# Altium schematic sheet MCU.SchDoc: Science - Microcontroller
size Letter; DrawnBy: C.Arjune; Organization: UW Robotics; Address1: 200 University Avenue; Address2: Waterloo; Address3: Ontario; Address4: Canada N2L 3G6; SheetNumber: 3; SheetTotal: 5
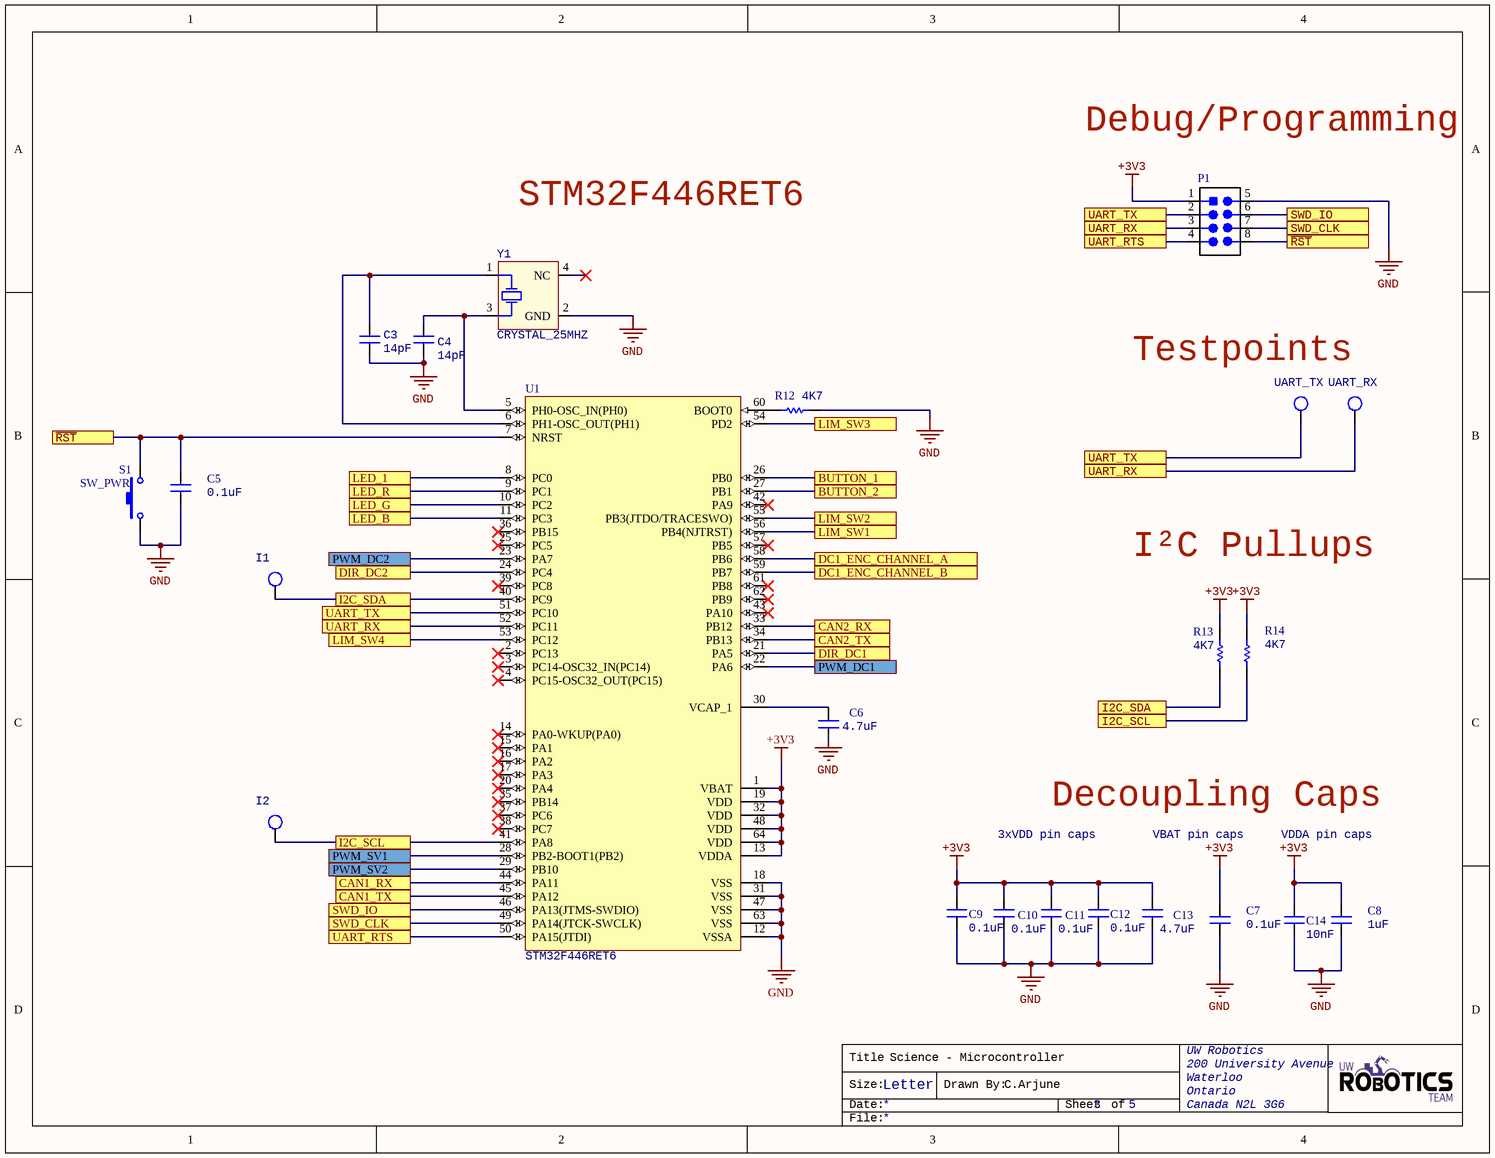
[diagram p0: MCU.SchDoc]

## Parts
C3  value 14pF  (hidden comment: CAP_14pF_50V_0603)
C4  value 14pF  (hidden comment: CAP_14pF_50V_0603)
C5  value 0.1uF  [CAPC0603(1608)55_N]  (hidden comment: CAP_0.1uF_16V_0603)
C6  value 4.7uF  [CAPC0603(1608)55_N]  (hidden comment: CAP_4.7uF_0603)
C7  value 0.1uF  [CAPC0603(1608)55_N]  (hidden comment: CAP_0.1uF_16V_0603)
C8  value 1uF  [CAPC0603(1608)55_N]  (hidden comment: CAP_1uF_16V_0603)
C9  value 0.1uF  [CAPC0603(1608)55_N]  (hidden comment: CAP_0.1uF_16V_0603)
C10  value 0.1uF  [CAPC0603(1608)55_N]  (hidden comment: CAP_0.1uF_16V_0603)
C11  value 0.1uF  [CAPC0603(1608)55_N]  (hidden comment: CAP_0.1uF_16V_0603)
C12  value 0.1uF  [CAPC0603(1608)55_N]  (hidden comment: CAP_0.1uF_16V_0603)
C13  value 4.7uF  [CAPC0603(1608)55_N]  (hidden comment: CAP_4.7uF_0603)
C14  value 10nF  [CAPC0603(1608)55_N]  (hidden comment: CAP_10nF_0603)
I1  TESTPOINT_LOOP  [TESTPOINT_LOOP]  (value not drawn)
I2  TESTPOINT_LOOP  [TESTPOINT_LOOP]  (value not drawn)
P1  HEADER 4X2  [HEADER_2X4]  (value not drawn)
R12  value 4K7  [RESC0603(1608)_N]  (hidden comment: RES_4K7_0603)
R13  value 4K7  [RESC0603(1608)_N]  (hidden comment: RES_4K7_0603)
R14  value 4K7  [RESC0603(1608)_N]  (hidden comment: RES_4K7_0603)
S1  SW_PWR  [PTS830GM140]
U1  STM32F446RET6  [STM-LQFP64_L]
UART_RX  TESTPOINT_LOOP  [TESTPOINT_LOOP]  (value not drawn)
UART_TX  TESTPOINT_LOOP  [TESTPOINT_LOOP]  (value not drawn)
Y1  CRYSTAL_25MHZ

## Ports
BUTTON_1, BUTTON_2, CAN1_RX, CAN1_TX, CAN2_RX, CAN2_TX, DC1_ENC_CHANNEL_A, DC1_ENC_CHANNEL_B, DIR_DC1, DIR_DC2, I2C_SCL, I2C_SDA, LED_1, LED_B, LED_G, LED_R, LIM_SW1, LIM_SW2, LIM_SW3, LIM_SW4, PWM_DC1, PWM_DC2, PWM_SV1, PWM_SV2, SWD_CLK, SWD_IO, UART_RTS, UART_RX, UART_TX, ~{RST}

## Nets
+3V3: C7.2 C8.2 C9.2 C10.2 C11.2 C12.2 C13.2 C14.2 P1.1(VCC) R13.2 R14.2 U1.1(VBAT) U1.13(VDDA) U1.19(VDD) U1.32(VDD) U1.48(VDD) U1.64(VDD)
GND: C3.1 C4.1 C5.1 C6.1 C7.1 C8.1 C9.1 C10.1 C11.1 C12.1 C13.1 C14.1 P1.5(GND) R12.1 S1.1 U1.12(VSSA) U1.18(VSS) U1.31(VSS) U1.47(VSS) U1.63(VSS) Y1.2(GND)
~{RST}: C5.2 P1.8 S1.2 U1.7(NRST) ; port ~{RST}
BUTTON_1: U1.26(PB0) ; port BUTTON_1
BUTTON_2: U1.27(PB1) ; port BUTTON_2
CAN1_RX: U1.44(PA11) ; port CAN1_RX
CAN1_TX: U1.45(PA12) ; port CAN1_TX
CAN2_RX: U1.33(PB12) ; port CAN2_RX
CAN2_TX: U1.34(PB13) ; port CAN2_TX
DC1_ENC_CHANNEL_A: U1.58(PB6) ; port DC1_ENC_CHANNEL_A
DC1_ENC_CHANNEL_B: U1.59(PB7) ; port DC1_ENC_CHANNEL_B
DIR_DC1: U1.21(PA5) ; port DIR_DC1
DIR_DC2: U1.24(PC4) ; port DIR_DC2
I2C_SCL: I2.1 R14.1 U1.41(PA8) ; port I2C_SCL
I2C_SDA: I1.1 R13.1 U1.40(PC9) ; port I2C_SDA
LED_1: U1.8(PC0) ; port LED_1
LED_B: U1.11(PC3) ; port LED_B
LED_G: U1.10(PC2) ; port LED_G
LED_R: U1.9(PC1) ; port LED_R
LIM_SW1: U1.56(PB4(NJTRST)) ; port LIM_SW1
LIM_SW2: U1.55(PB3(JTDO/TRACESWO)) ; port LIM_SW2
LIM_SW3: U1.54(PD2) ; port LIM_SW3
LIM_SW4: U1.53(PC12) ; port LIM_SW4
PWM_DC1: U1.22(PA6) ; port PWM_DC1
PWM_DC2: U1.23(PA7) ; port PWM_DC2
PWM_SV1: U1.28(PB2-BOOT1(PB2)) ; port PWM_SV1
PWM_SV2: U1.29(PB10) ; port PWM_SV2
SWD_CLK: P1.7 U1.49(PA14(JTCK-SWCLK)) ; port SWD_CLK
SWD_IO: P1.6 U1.46(PA13(JTMS-SWDIO)) ; port SWD_IO
UART_RTS: P1.4 U1.50(PA15(JTDI)) ; port UART_RTS
UART_RX: P1.3 U1.52(PC11) UART_RX.1 ; port UART_RX
UART_TX: P1.2 U1.51(PC10) UART_TX.1 ; port UART_TX
NetC3_2: C3.2 U1.6(PH1-OSC_OUT(PH1)) Y1.1(HOT)
NetC4_2: C4.2 U1.5(PH0-OSC_IN(PH0)) Y1.3(HOT)
NetC6_2: C6.2 U1.30(VCAP_1)
NetR12_2: R12.2 U1.60(BOOT0)

Not connected (* = marked no-connect by the designer): U1 2(PC13)* 3(PC14-OSC32_IN(PC14))* 4(PC15-OSC32_OUT(PC15))* 14(PA0-WKUP(PA0))* 15(PA1)* 16(PA2)* 17(PA3)* 20(PA4)* 25(PC5)* 35(PB14)* 36(PB15)* 37(PC6)* 38(PC7)* 39(PC8)* 42(PA9)* 43(PA10)* 57(PB5)* 61(PB8)* 62(PB9)*; Y1 4(NC)*

## Notes on the sheet
- Debug/Programming
- STM32F446RET6
- Testpoints
- I²C Pullups
- 3xVDD pin caps
- Decoupling Caps
- VBAT pin caps
- VDDA pin caps
- Title
- Size:
- Date:
- Letter
- Drawn By:
- Sheet
- of
- File:

## Library data of the parts
C3 C4 = CAP_14pF_50V_0603: CAP CER 14PF 50V C0G/NP0 0603; Manufacturer 1: Samsung; Manufacturer Part Number 1: CL10C140JB8NNNC; Tolerance: 5%; Dielectric: C0G; Voltage Rating: 50V; Supplier Part Number 1: 1276-2187-1-ND; Supplier 1: Digi-Key; Stock 1: 187088; Pricing 1: 1=0.10000, 10=0.06700, 100=0.02980, 500=0.02130, 1000=0.01673 (USD); RoHS: Yes; Mount: Surface Mount; Case/Package: 0603; Case Code (Metric): 1608; Case Code (Imperial): 0603; Min Operating Temperature: -55°C; Max Operating Temperature: 125°C; Package Quantity: 1; Packaging: Tape and Reel; Voltage Rating (DC): 50V; Length: 1.6mm; Height: 0.8mm; Width: 0.031inch; Depth: 0.8mm; Thickness: 0.035inch; Radiation Hardening: No; ComponentLink1URL: https://datasheet.ciiva.com/25782/cl10c140jb8nnnc-25782947.pdf?src-supplier=Digi-Key; ComponentLink1Description: https://datasheet.ciiva.com/25782/cl10c140jb8nnnc-25782947.pdf?src-supplier=Digi-Key; Capacitance: 14pF
C5 C7 C9-C12 = CAP_0.1uF_16V_0603: CAP CER 0.1UF 16V X7R 0603; Manufacturer: Yageo; MPN: CC0603KRX7R7BB104; Dimensions: 0.063" L x 0.031" W (1.60mm x 0.80mm); Package: 0603 (1608 Metric); Temperature Coefficient: X7R; Voltage Rating: 16V; Supplier Part Number 1: 311-1088-1-ND; Supplier 1: Digi-Key
C6 C13 = CAP_4.7uF_0603: CAP CER 4.7UF 6.3V X5R 0603; Manufacturer: Yageo; MPN: CC0603KRX5R5BB475; Dimensions: 0.063" L x 0.031" W (1.60mm x 0.80mm); Package: 0603 (1608 Metric); Temperature Coefficient: X5R; Voltage Rating: 6.3V; Supplier Part Number 1: 311-1521-1-ND; Supplier 1: Digi-Key
C8 = CAP_1uF_16V_0603: CAP CER 1UF 16V Y5V 0603; Manufacturer: Yageo; MPN: CC0603ZRY5V7BB105; Dimensions: 0.063" L x 0.031" W (1.60mm x 0.80mm); Package: 0603 (1608 Metric); Temperature Coefficient: Y5V; Voltage Rating: 16V; Supplier Part Number 1: 311-1372-1-ND; Supplier 1: Digi-Key
C14 = CAP_10nF_0603: CAP CER 10000PF 16V X7R 0603; Manufacturer: Yageo; MPN: CC0603KRX7R7BB103; Dimensions: 0.063" L x 0.031" W (1.60mm x 0.80mm); Package: 0603 (1608 Metric); Temperature Coefficient: X7R; Voltage Rating: 16V; Supplier Part Number 1: 311-3369-1-ND; Supplier 1: Digi-Key
I1 I2 UART_RX UART_TX = TESTPOINT_LOOP: Loop testpoint through-hole pad; Manufacturer: Keystone Electronics; Manufacturer Part Number 1: 5002; Supplier Part Number 1: 36-5002-ND; Supplier 1: Digi-Key
P1 = HEADER 4X2: CONN HEADER VERT 8POS 2.54MM; Manufacturer Part Number 1: M20-9980445; Manufacturer 1: Harwin Inc.; Supplier Part Number 1: 952-2122-ND; Supplier 1: Digi-Key
R12-R14 = RES_4K7_0603: RES SMD 4.7K OHM 5% 1/10W 0603; Manufacturer: Yageo; MPN: RC0603JR-074K7L; Package: 0603 (1608 Metric); Dimensions: 0.063" L x 0.031" W (1.60mm x 0.80mm); Tolerance: 5%; Supplier Part Number 1: 311-4.7KGRCT-ND; Supplier 1: Digi-Key
S1 = SW_PWR: Power Switch (Red); pin to pad: 2>4; MPN: PTS830GM140 SMTR LFS; Manufacturer: C&K; ComponentLink1Description: Datasheet; ComponentLink1URL: https://www.ckswitches.com/media/1478/pts830.pdf; Supplier Part Number 1: CKN10587CT-ND; Supplier 1: Digi-Key
U1 = MCU_STM32F446RET6: ARM Cortex-M4 32-bit MCU+FPU, 512 KB Flash, 128 KB Internal RAM, 50 I/Os, 64-Pin LQFP, -40 to 85 degC, Tray; I/Os (High Current): 50; Supply Voltage(Vcc) min (V): 1.7; Operating Frequency(F) (Processor speed) (MHz): 180; D/A Converter: 2; Internal RAM Size (kB): 128; FLASH Size (Prog) (kB): 512; Core: ARM Cortex-M4; ComponentLink1Description: Manufacturer URL; Package Reference: 64-Pin Low-profile Quad Flat Package, Body 10 x 10 mm, Pitch 0.5 mm; ComponentLink2URL: http://www.st.com/st-web-ui/static/active/en/resource/technical/document/datasheet/DM00141306.pdf; Packing: Tray; DatasheetVersion: Rev. 6; ComponentLink1URL: http://www.st.com/; ComponentLink2Description: Datasheet; Package Description: LQFP64; Mounting Technology: Surface Mount; Supplier 1: Digi-Key; Supplier Part Number 1: 497-15376-ND
Y1 = CRYSTAL_25MHZ: CRYSTAL 25.0000MHZ 12PF SMD; Manufacturer 1: Kyocera AVX; Manufacturer Part Number 1: CX2520DB25000H0FLJC1; Frequency: 25MHz; ESR (Equivalent Series Resistance): 80R; Frequency Stability: 15ppm; Frequency Tolerance: 10ppm; ComponentLink1Description: https://media.digikey.com/pdf/Data%20Sheets/AVX%20PDFs/CX2520DB_USY1M-H1-16429-00_Spec.pdf?src-supplier=Digi-Key; ComponentLink1URL: https://media.digikey.com/pdf/Data%20Sheets/AVX%20PDFs/CX2520DB_USY1M-H1-16429-00_Spec.pdf?src-supplier=Digi-Key; Supplier 1: Digi-Key; Supplier Part Number 1: 1253-1724-1-ND; Stock 1: 11741; Pricing 1: 1=0.72000, 10=0.63300, 50=0.59120, 100=0.52250, 500=0.49500, 1000=0.41250 (USD); RoHS: Yes; Mount: Surface Mount; Case/Package: SMD/SMT; Min Operating Temperature: -30°C; Max Operating Temperature: 85°C; Packaging: Tape and Reel; Load Capacitance: 12pF; Length: 0.098inch; Height: 0.022inch; Width: 0.079inch; Ratings: AEC-Q200